# Altium schematic sheet Power Supply.SchDoc
size A4
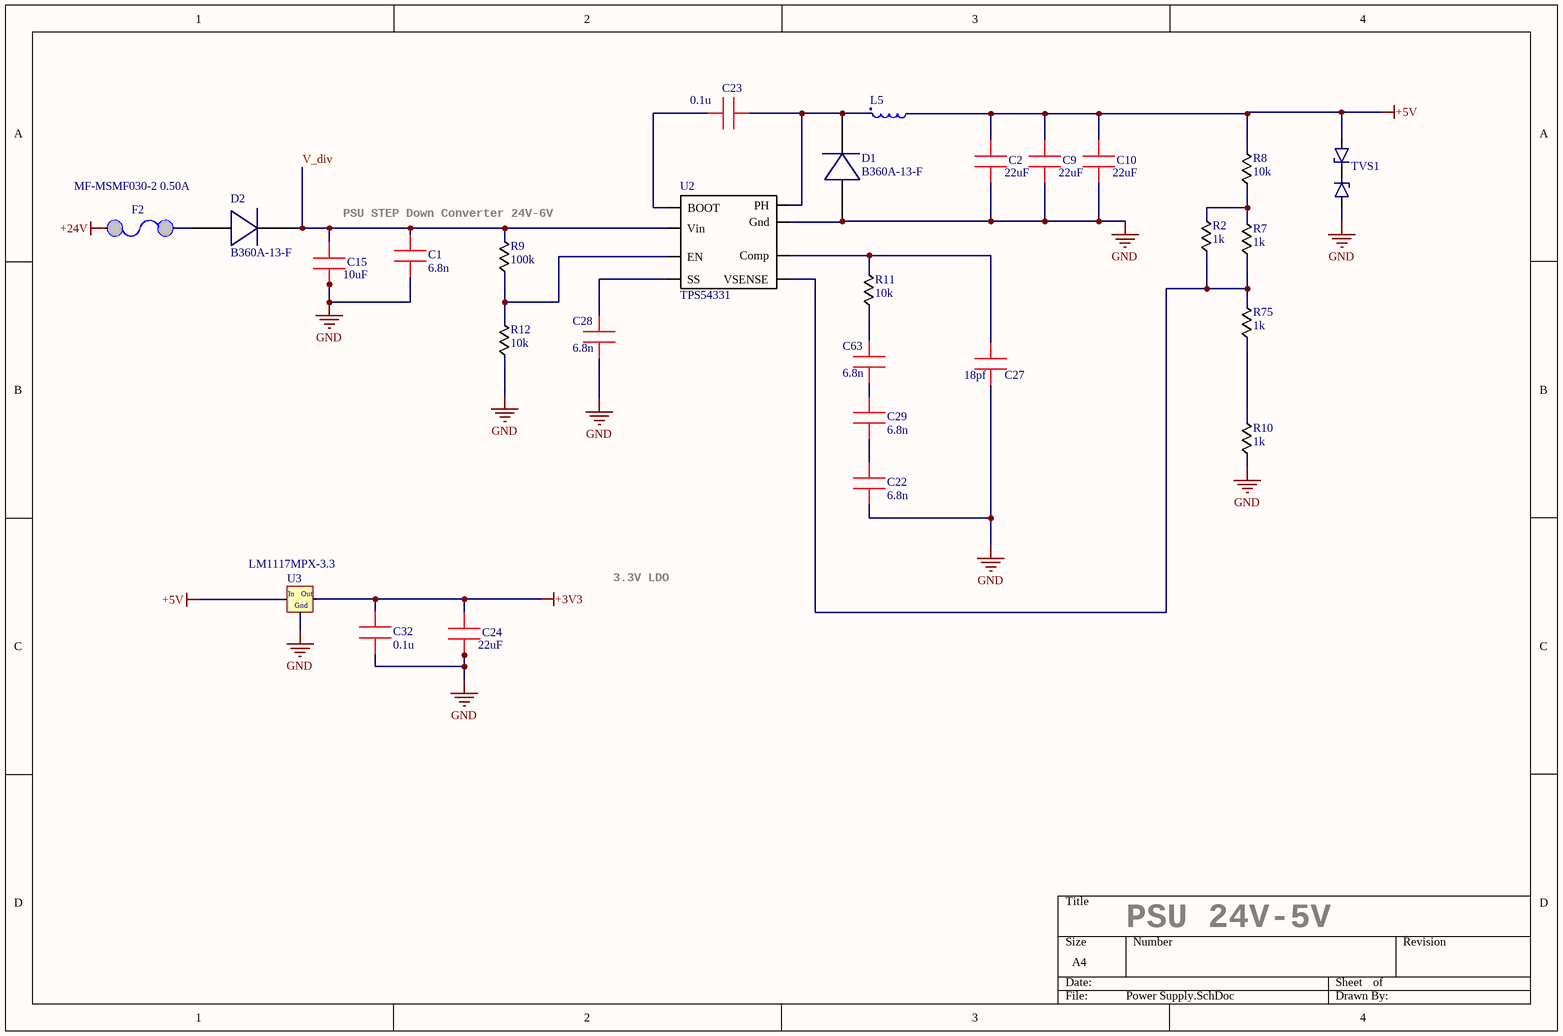
[diagram p0: Power Supply.SchDoc]

## Parts
C1  6.8n  [0603 CAP]
C2  22uF  [CAP CER 1210 NP]
C9  22uF  [CAP CER 1210 NP]
C10  22uF  [CAP CER 1210 NP]
C15  10uF  [CAP CER 1210 NP]
C22  6.8n  [0603 CAP]
C23  0.1u  [0603 CAP]
C24  22uF  [CAP CER 1210 NP]
C27  18pf  [0603 CAP]
C28  6.8n  [0603 CAP]
C29  6.8n  [0603 CAP]
C32  0.1u  [0603 CAP]
C63  6.8n  [0603 CAP]
D1  B360A-13-F  [B340A-13-F]
D2  B360A-13-F  [B340A-13-F]
F2  MF-MSMF030-2 0.50A  [Fuse PTS]
L5  CDRH127/LDNP-220MC  [CDRH127/LDNP-270MC,]  (value not drawn)
R2  1k  [0603 - RES]
R7  1k  [0603 - RES]
R8  10k  [0603 - RES]
R9  100k  [0603 - RES]
R10  1k  [0603 - RES]
R11  10k  [0603 - RES]
R12  10k  [0603 - RES]
R75  1k  [0603 - RES]
TVS1  TVS Diode  [SM6T]  (value not drawn)
U2  TPS54331  [SOIC-8]
U3  LM1117MPX-3.3  [SOT223]

## Nets
+3V3: C24.2 C32.1 U3.2(OUT)
+5V: C2.2 C9.2 C10.2 L5.2 R8.2 TVS1.2 U3.3(IN)
+24V: F2.2
GND: C1.1 C2.1 C9.1 C10.1 C15.1 C22.1 C24.1 C27.1 C28.1 C32.2 D1.2 R10.1 R12.1 TVS1.1 U2.7(Gnd) U3.1(GND)
V_div: C1.2 C15.2 D2.1 R9.2 U2.2(Vin)
NetC22_2: C22.2 C29.1
NetC23_1: C23.1 U2.1(BOOT)
NetC23_2: C23.2 D1.1 L5.1 U2.8(PH)
NetC27_2: C27.2 R11.2 U2.6(Comp)
NetC28_2: C28.2 U2.4(SS)
NetC29_2: C29.2 C63.1
NetC63_2: C63.2 R11.1
NetD2_2: D2.2 F2.1
NetR2_1: R2.1 R7.1 R75.2 U2.5(VSENSE)
NetR2_2: R2.2 R7.2 R8.1
NetR9_1: R9.1 R12.2 U2.3(EN)
NetR10_2: R10.2 R75.1

## Notes on the sheet
- PSU STEP Down Converter 24V-6V
- 3.3V LDO
- PSU 24V-5V
- (in symbol NCV1117ST50T3G) In; Out; Gnd

## Library data of the parts
C1 C22 = 0603 CAP: CC0603KRX7R9BB682
C2 C9 C10 C24 = 0805 Cap: CC1210KKX5R7BB226
C15 = 0805 Cap: GRM32ER71H106KA12L
C23 C28 C29 C63 = 0805 Cap: GRM188R71E104KA01D
C27 = 0805 Cap: GRM1885C1H180JA01D
C32 = Capasitor 0805
D1 D2 = B340A-13-F
F2 = Fuse PTS
L5 = CDRH127/LDNP-270MC
R2 R7 R10 R75 = Resistor 0805: RC0603FR-078K2
R8 R11 R12 = Resistor 0805: RT0603FRE0710KL
R9 = 0603 RES: RC0603FR-07100KL
TVS1 = SM6T12CA
U3 = NCV1117ST50T3G